# Altium schematic sheet RF_Sensors.SchDoc
size A4; SheetNumber: 3; SheetTotal: 5
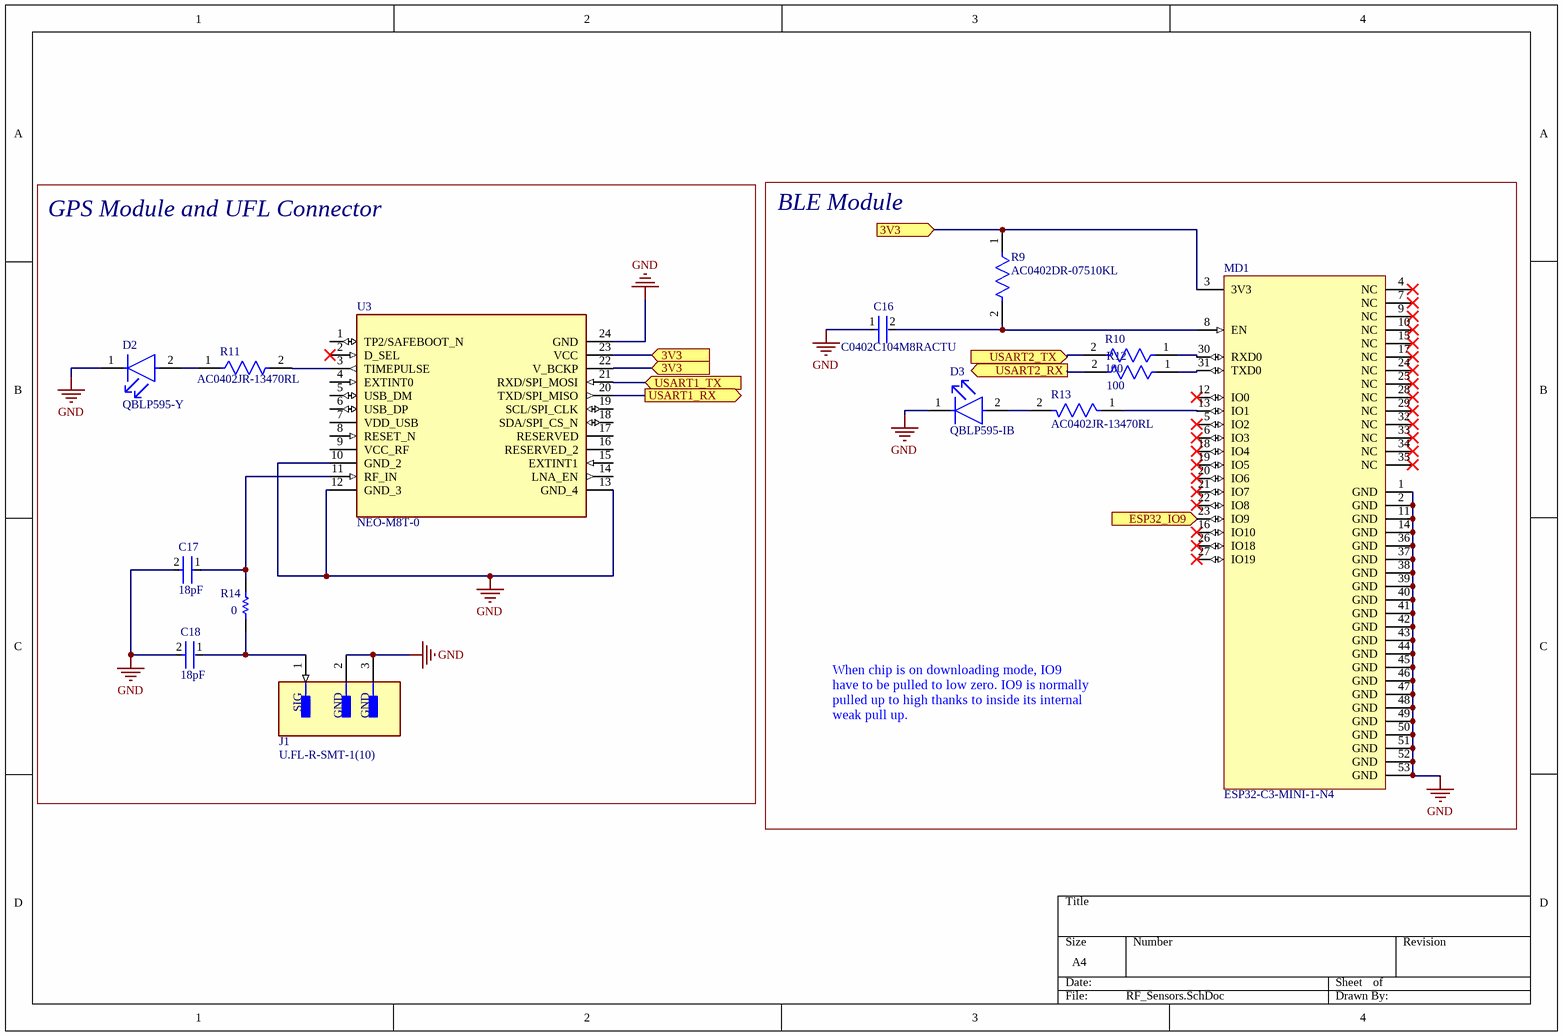
[diagram p0: RF_Sensors.SchDoc]

## Parts
C16  C0402C104M8RACTU  [FP-C0402-BB-MFG]
C17  18pF  [FP-CBR04C-MFG]
C18  18pF  [FP-CBR04C-MFG]
D2  QBLP595-Y  [FP-QBLP595-Y-MFG]
D3  QBLP595-IB  [FP-QBLP595-IB-MFG]
J1  U.FL-R-SMT-1(10)  [FP-U_FL-R-SMT-1_10-MFG]
MD1  ESP32-C3-MINI-1-N4  [FP-ESP32-C3-MINI-1-N4-MFG]
R9  AC0402DR-07510KL  [FP-AC0402-IPC_C]
R10  100  [FP-AC0402-MFG]
R11  AC0402JR-13470RL  [FP-AC0402-MFG]
R12  100  [FP-AC0402-MFG]
R13  AC0402JR-13470RL  [FP-AC0402-MFG]
R14  0  [RESC1005X40X25NL05T10]
U3  NEO-M8T-0  [NEO-M8T_UBL]

## Blocks framed on the sheet
GPS Module and UFL Connector: C17 C18 D2 J1 R11 R14 U3
BLE Module: C16 D3 MD1 R9 R10 R12 R13

## Ports
3V3 (in, see Top_Sheet[4B], Connectors[1C], Connectors[2A], Connectors[3A], Connectors[3C], MCU,SD,FLASH[3C], MCU,SD,FLASH[4A], MCU,SD,FLASH[4B], MCU,SD,FLASH[5A], MCU,SD,FLASH[5C], MCU,SD,FLASH[6B], MCU,SD,FLASH[6C], MCU,SD,FLASH[7A], Power[3C]), ESP32_IO9 (in, see Top_Sheet[3B], Connectors[1C]), USART1_RX (out, see Top_Sheet[3A], MCU,SD,FLASH[2B]), USART1_TX (in, see Top_Sheet[3A], MCU,SD,FLASH[2B]), USART2_RX (out, see Top_Sheet[3B], Connectors[2C], MCU,SD,FLASH[2B]), USART2_TX (in, see Top_Sheet[3B], Connectors[1C], MCU,SD,FLASH[2A])

## Nets
GND: C16.1 C17.2 C18.2 D2.1(C) D3.1(C) J1.2(GND) J1.3(GND) MD1.1(GND) MD1.2(GND) MD1.11(GND) MD1.14(GND) MD1.36(GND) MD1.37(GND) MD1.38(GND) MD1.39(GND) MD1.40(GND) MD1.41(GND) MD1.42(GND) MD1.43(GND) MD1.44(GND) MD1.45(GND) MD1.46(GND) MD1.47(GND) MD1.48(GND) MD1.49(GND) MD1.50(GND) MD1.51(GND) MD1.52(GND) MD1.53(GND) U3.10(GND_2) U3.12(GND_3) U3.13(GND_4) U3.24(GND)
3V3: MD1.3(3V3) R9.1 U3.22(V_BCKP) U3.23(VCC) ; port 3V3
ESP32_IO9: MD1.23(IO9) ; port ESP32_IO9
USART1_RX: U3.20(TXD/SPI_MISO) ; port USART1_RX
USART1_TX: U3.21(RXD/SPI_MOSI) ; port USART1_TX
USART2_RX: R12.2 ; port USART2_RX
USART2_TX: R10.2 ; port USART2_TX
NetC16_2: C16.2 MD1.8(EN) R9.2
NetC17_1: C17.1 R14.1 U3.11(RF_IN)
NetC18_1: C18.1 J1.1(SIG) R14.2
NetD2_2: D2.2(A) R11.1
NetD3_2: D3.2(A) R13.2
NetMD1_13: MD1.13(IO1) R13.1
NetMD1_30: MD1.30(RXD0) R10.1
NetMD1_31: MD1.31(TXD0) R12.1
NetR11_2: R11.2 U3.3(TIMEPULSE)

Not connected (* = marked no-connect by the designer): MD1 4(NC)* 5(IO2)* 6(IO3)* 7(NC)* 9(NC)* 10(NC)* 12(IO0)* 15(NC)* 16(IO10)* 17(NC)* 18(IO4)* 19(IO5)* 20(IO6)* 21(IO7)* 22(IO8)* 24(NC)* 25(NC)* 26(IO18)* 27(IO19)* 28(NC)* 29(NC)* 32(NC)* 33(NC)* 34(NC)* 35(NC)*; U3 1(TP2/SAFEBOOT_N) 2(D_SEL)* 4(EXTINT0) 5(USB_DM) 6(USB_DP) 7(VDD_USB) 8(RESET_N) 9(VCC_RF) 14(LNA_EN) 15(EXTINT1) 16(RESERVED_2) 17(RESERVED) 18(SDA/SPI_CS_N) 19(SCL/SPI_CLK)

## Notes on the sheet
- When chip is on downloading mode, IO9 have to be pulled to low zero. IO9 is normally pulled up to high thanks to inside its internal weak pull up.

## Library data of the parts
C16 = CMP-1034-02066-3: CAP CER 0.1UF 10V 20% X7R 0402; Manufacturer: Kemet; Tolerance: 0.2; Capacitance: 0.10 μF; Value: 0.10 μF; Material: Ceramic; Temperature Coefficient: 15%; Temperature Range Low: -55°C; Device Class L3: Ceramic Capacitors; RoHS: TRUE; Automotive: No; Device Class L2: Capacitors; Temperature Characteristic: X7R; Octopart: https://octopart.com/c0402c104m8ractu-kemet-9144037; Digikey Description: CAP CER 0.1UF 10V 20% X7R 0402; Mouser Description: Multilayer Ceramic Capacitors MLCC - SMD/SMT 10volts 0.1uF X7R 20%; Ipc Land Pattern Name: CAPC10050X50; Manufacturer Part Number: C0402C104M8RACTU; Voltage Rating: 10 V; Lead Free: Yes; Device Class L1: Passive Components; ComponentLink2URL: https://content.kemet.com/datasheets/KEM_C1002_X7R_SMD.pdf; Category: Cap; ComponentLink2Description: Datasheet; Temperature Range High: +125°C; Height: 0.55mm; Temperature: -55°C to +125°C; Package: C0402-BB
C17 C18 = CMP-03020-010714-1: CAP CER 18PF 100V C0G/NP0 0402; Manufacturer Part Number: CBR04C180F1GAC; Manufacturer: KEMET; Material: Ceramic; Tolerance: 0.01; Description: CBR0402 18 pF 30ppm/°C 1.00% C0G 100 V; Temperature Coefficient: 30ppm/°C; Temperature Characteristic: C0G; Mouser Description: Multilayer Ceramic Capacitors MLCC - SMD/SMT 100volts 18pF C0G 0402 1% Tol RF; Device Class L1: Passive Components; RoHS: TRUE; Device Class L3: Ceramic Capacitors; Package: CBR04C; Digikey Description: CAP CER 18PF 100V C0G/NP0 0402; Ipc Land Pattern Name: CAPC10050X50; Device Class L2: Capacitors; Category: Cap; Temperature Range Low: -55°C; Temperature Range High: +125°C; ComponentLink2Description: Datasheet; Temperature: -55°C to +125°C; Octopart: https://octopart.com/cbr04c180f1gac-kemet-30609230; Capacitance: 18 pF; Automotive: No; Lead Free: Yes; Value: 18 pF; ComponentLink2URL: https://content.kemet.com/datasheets/KEM_C1030_CBR_SMD.pdf; Voltage Rating: 100 V; Height: 0.55mm
D2 = CMP-113271-000003-1: LED YELLOW CLEAR 0402 SMD; Lens Color: Colorless; Lens Style: Flat; Lens Size: 0.5mm; Luminous Intensity: 95mcd; Forward Voltage: 2V; Dominant Wavelength: 590nm; Viewing Angle: 140°; Test Current: 20mA; Mount: Surface Mount; Height: 0.6mm; Lens Transparency: Clear; Case Code (Imperial): 0402; Case Code (Metric): 1005; Case/Package: 0402; Packaging: Tape and Reel; Width: 0.5mm; Color: Yellow; Length: 1mm
D3 = CMP-113271-000002-1: LED BLUE CLEAR 0402 SMD; Lens Size: 0.5mm; Dominant Wavelength: 465nm; Forward Voltage: 3.1V; Lens Color: Colorless; Luminous Intensity: 85mcd; Test Current: 20mA; Viewing Angle: 140°; Lens Style: Flat; Width: 0.5mm; Case Code (Metric): 1005; Lens Transparency: Clear; Color: Blue; Packaging: Tape and Reel; Case Code (Imperial): 0402; Mount: Surface Mount; Length: 1mm; Case/Package: 0402; Height: 0.6mm
J1 = CMP-2000-05152-3: CONN U.FL RCPT STR 50 OHM SMD; Max Frequency: 6GHz; Connector Type: Coaxial; Body Plating: Silver; Body Material: Bronze; Impedance: 50R; Dielectric Material: Polymer; Insulation Resistance: 500MR; Gender: Male; Packaging: Cut Tape; Length: 3mm; Package Quantity: 2500; Termination: Solder; Lead Free: Lead Free; Series: U.FL; Min Operating Temperature: -40°C; Fastening Type: Snap; Contact Material: Brass; Orientation: Straight; Wire/Cable Type: Coaxial; Frequency: 6GHz; Contact Plating: Gold; Depth: 3.1mm; Weight: 0.001764oz; Max Operating Temperature: 90°C; Radiation Hardening: No; REACH SVHC: No SVHC; Mount: Surface Mount; Housing Color: Beige
MD1 = CMP-10700-116589975-1: Multiprotocol Modules SMD module, ESP32-C3FN4, PCB antenna, -40 C +85 C; Max Frequency: 2.484GHz; Min Supply Voltage: 3V; Current - Transmitting: 350mA; Interface: SPI; Data Rate: 150Mbps; Max Supply Voltage: 3.6V; Number of GPIO: 13; Current - Receiving: 84mA; Min Operating Temperature: -40°C; Height: 2.55mm; Ambient Temperature Range High: 85°C; Max Operating Temperature: 85°C
R9 = CMP-03412-042271-1: RES 510kΩ ±0.5% 0.063W 0402; RoHS Compliant: Yes
R10 R12 = CMP-03412-022855-2: RES 100Ω ±1% 0.063W 0402; Resistance: 100R; RoHS Compliant: Yes; Tolerance: 1%; Case/Package: 0402
R11 R13 = CMP-03412-049712-1: RES 470Ω ±5% 0.063W 0402
R14 = CMP-2002-06970-1: Part Number: RC0402JR-100RL; Manufacturer: Yageo
U3 = NEO-M8T-0: series RF Receiver BeiDou, Galileo, GLONASS, GNSS, GPS - -167dBm - - -; MF: U-Blox; SnapEDA_Link: https://www.snapeda.com/parts/NEO-M8T-0/u-blox/view-part/?ref=snap; Package: SMD-24 u-blox; Value: *; MP: NEO-M8T-0; Check_prices: https://www.snapeda.com/parts/NEO-M8T-0/u-blox/view-part/?ref=eda